# Altium schematic sheet GPS.SchDoc
size B; SheetNumber: 5; SheetTotal: 9
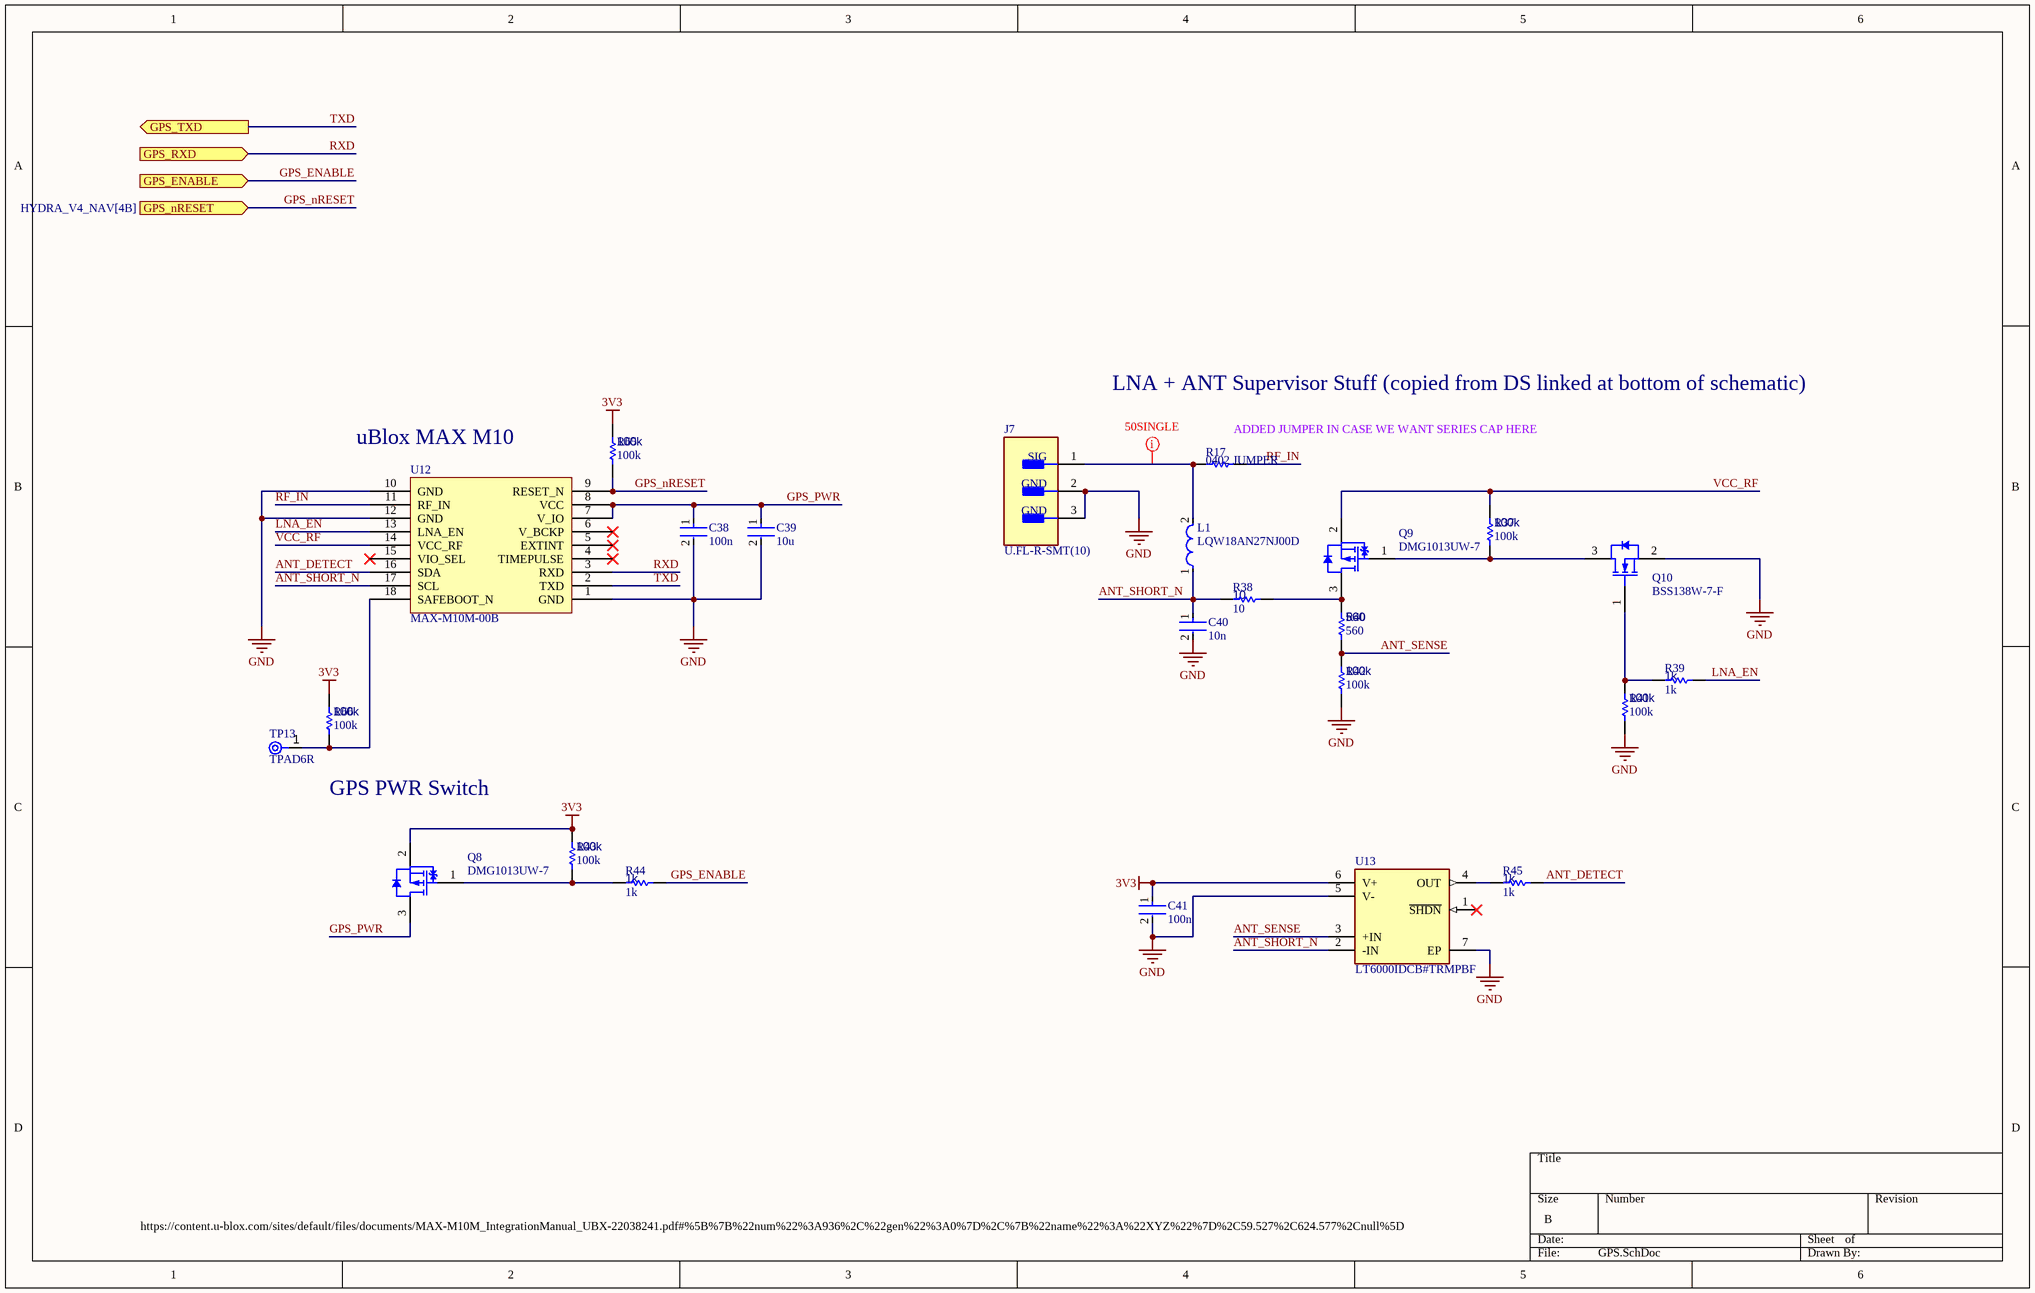
[diagram p0: GPS.SchDoc]

## Parts
C38  100n  [FP-0402-L_1_0_0_05-W_0_5-IPC_A]
C39  10u  [FP-0402-L_1_0_0_05-W_0_5-IPC_A]
C40  10n  [FP-0402-L_1_0_0_05-W_0_5-IPC_A]
C41  100n  [FP-0402-L_1_0_0_05-W_0_5-IPC_A]
J7  U.FL-R-SMT(10)  [FP-U_FL-R-SMT_10-MFG]
L1  LQW18AN27NJ00D  [FP-LQW18AN_00-MFG]
Q8  DMG1013UW-7  [DIOD-SOT323-3_V]
Q9  DMG1013UW-7  [DIOD-SOT323-3_V]
Q10  BSS138W-7-F  [DIOD-SOT323-3_V]
R17  0402 JUMPER  [RESC1005X40X25ML05T05]
R37  100k  [R0603B]
R38  10  [R0603B]
R39  1k  [R0603B]
R40  560  [R0603B]
R41  100k  [R0603B]
R42  100k  [R0603B]
R43  100k  [R0603B]
R44  1k  [R0603B]
R45  1k  [R0603B]
R65  100k  [R0603B]
R66  100k  [R0603B]
TP13  TPAD6R  [New footprint 1]
U12  MAX-M10M-00B  [MAX-M10M-00B-Footprint-1]
U13  LT6000IDCB#TRMPBF  [FP-DCB-6-05-08-1715-MFG]

## Ports
GPS_ENABLE (in, see HYDRA_V4_NAV[4B]), GPS_nRESET (in, see HYDRA_V4_NAV[4B]), GPS_RXD (in, see HYDRA_V4_NAV[4B]), GPS_TXD (out, see HYDRA_V4_NAV[4B])

## Nets
3V3: C41.1 Q8.2(S) R43.1 R65.1 R66.1 U13.6(V+)
GND: C38.2 C39.2 C40.2 C41.2 J7.2(GND) J7.3(GND) Q10.2(S) R41.2 R42.2 U12.1(GND) U12.10(GND) U12.12(GND) U13.5(V-) U13.7(EP)
ANT_DETECT: R45.2 U12.16(SDA)
ANT_SENSE: R40.2 R42.1 U13.3(+IN)
ANT_SHORT_N: C40.1 L1.1 R38.1 U12.17(SCL) U13.2(-IN)
GPS_ENABLE: R44.2 ; port GPS_ENABLE
GPS_nRESET: R65.2 U12.9(RESET_N) ; port GPS_nRESET
GPS_PWR: C38.1 C39.1 Q8.3(D) U12.7(V_IO) U12.8(VCC)
LNA_EN: R39.2 U12.13(LNA_EN)
RF_IN: R17.2 U12.11(RF_IN)
RXD: U12.3(RXD) ; port GPS_RXD
TXD: U12.2(TXD) ; port GPS_TXD
VCC_RF: Q9.2(S) R37.1 U12.14(VCC_RF)
NetJ7_1: J7.1(SIG) L1.2 R17.1
NetQ8_1: Q8.1(G) R43.2 R44.1
NetQ9_1: Q9.1(G) Q10.3(D) R37.2
NetQ9_3: Q9.3(D) R38.2 R40.1
NetQ10_1: Q10.1(G) R39.1 R41.1
NetR45_1: R45.1 U13.4(OUT)
NetR66_2: R66.2 TP13.1(TP) U12.18(SAFEBOOT_N)

Not connected (* = marked no-connect by the designer): U12 4(TIMEPULSE)* 5(EXTINT)* 6(V_BCKP)* 15(VIO_SEL)*; U13 1(~{SHDN})*

## Layout directives
net class 50SINGLE: NetJ7_1

## Notes on the sheet
- LNA + ANT Supervisor Stuff (copied from DS linked at bottom of schematic)
- (near R17) ADDED JUMPER IN CASE WE WANT SERIES CAP HERE
- (near U12) uBlox MAX M10
- GPS PWR Switch
- https://content.u-blox.com/sites/default/files/documents/MAX-M10M_IntegrationManual_UBX-22038241.pdf#%5B%7B%22num%22%3A936%2C%22gen%22%3A0%7D%2C%7B%22name%22%3A%22XYZ%22%7D%2C59.527%2C624.577%2Cnull%5D

## Library data of the parts
C38-C41 = CMP-001-00058-1: LARGE PADS, 0402 CAP, CHANGE COMMENT TO MATCH REAL P/N; Capacitor Type: Ceramic; Min Operating Temperature: -55°C; Mounting Technology: Surface Mount; Pins: 2; Case/Package: 0402; RoHS Compliant: Yes; Max Operating Temperature: 85°C
  C38 C41: Value: 100n
  C39: Value: 10u
  C40: Value: 10n
J7 = CMP-0029-00003-2: CONN U.FL RCPT STR 50 OHM SMD; Plating: Silver; Connector Type: Coaxial; Frequency: 6GHz; Impedance: 50R; Body Material: Bronze; Dielectric Material: Polymer; Contact Plating: Gold; Termination: Solder; Orientation: Vertical; Contact Material: Brass; Min Operating Temperature: -40°C; Mount: Surface Mount; Lead Free: Lead Free; Max Operating Temperature: 90°C; Radiation Hardening: No; Packaging: Tape and Reel; Body Plating: Silver; Fastening Type: Snap; Max Frequency: 6GHz; Depth: 3.1mm; Package Quantity: 1; Case/Package: SMD/SMT; Housing Color: Beige; Length: 3mm
L1 = CMP-06042-013840-1: Wire Wound RF Inductor 27nH ±5% 440mA 0.21Ω 0603 (1608); Shielding: Unshielded; Test Frequency: 100MHz; Q Factor: 40; Self Resonant Frequency: 3.7GHz; DC Resistance (DCR): 210mR; Core Material: Non-Magnetic; Depth: 1mm; Min Operating Temperature: -55°C; Package Quantity: 4000; Inductance: 27nH; Case Code (Metric): 1608; Height - Seated (Max): 0.039inch; Resistor Type: Wirewound; Max DC Current: 440mA; Tolerance: 5%; Length: 1.6mm; Mount: Surface Mount; DC Current: 440mA; Packaging: Tape and Reel; Lead Free: Lead Free; Case Code (Imperial): 0603; Current Rating: 440mA; Width: 0.8mm; Max Operating Temperature: 125°C; Termination: SMD/SMT; Weight: 0.000106oz; Radiation Hardening: No; Height: 0.8mm; Case/Package: 0603; Military Standard: Not
Q8 Q9 = CMP-2000-06170-1: P-Channel Enhancement Mode MOSFET, 310 mW, 20 V, -55 to 150 degC, 3-Pin SOT-323, RoHS, Tape and Reel; Manufacturer: Diodes Inc; Qg Gate Charge: 0.622nC; Drain-Source On Resistance-Max: 750mO; Rated Power Dissipation: 310mW; Drain-to-Source Voltage [Vdss]: 20V; Package Reference: SOT323; Datasheet Version: Rev. 3-2, 09/2013; Package Description: 3-Pin Small Outline Transistor, Body 2 x 1.25 mm, Pitch 0.65 mm; Mounting Technology: SurfaceMount; Manufacturer URL: http://www.diodes.com/; Datasheet URL: http://www.diodes.com/_files/datasheets/ds31861.pdf; Channel Type: P-Channel
Q10 = CMP-2000-05968-1: N-Channel Enhancement Mode Mosfet, 50 V, 200 mA, -55 to 150 degC, 6-Pin SOT-323, RoHS, Tape and Reel; Typical Turn-Off Delay Time: 20ns; Number of Channels: 1Channel; Type: EnhancementModeFieldEffectTransistor; Brand: DiodesIncorporated; Vds - Drain-Source Breakdown Voltage: 75V; Vgs - Gate-Source Voltage: 20V; Rds On - Drain-Source Resistance: 1.4Ohms; Transistor Type: 1N-Channel; Configuration: Single; Unit Weight: 0.000212oz; Pd - Power Dissipation: 200mW; Id - Continuous Drain Current: 200mA; Forward Transconductance - Min: 0.1S; Manufacturer URL: http://www.diodes.com/; Series: BSS138; Package Description: 3-Pin Small Outline Transistor, Body 2 x 1.25 mm, Pitch 0.65 mm; Mounting Technology: SurfaceMount; Product Category: MOSFET; RoHS: True; Maximum Operating Temperature: +150C; Height: 1mm; Length: 2.2mm; Technology: Si; Width: 1.35mm; Datasheet URL: http://www.diodes.com/_files/datasheets/ds30206.pdf; Manufacturer: DiodesIncorporated; Package / Case: SOT-323-3; Typical Turn-On Delay Time: 20ns; Transistor Polarity: N-Channel; Factory Pack Quantity: 3000; Packaging: Reel; Product: MOSFETSmallSignal; Datasheet Version: Rev. 11-2, 09/2013; Package Reference: SOT323; Minimum Operating Temperature: -55C; Mounting Style: SMD/SMT; Channel Mode: Enhancement
R17 = CMP-009-00118-2: READ THE NAME; Pins: 2; Component Type: Standard; Design Item ID: CMP-009-00206-2; Source: 0402jump.SchLib; Value: 0402 JUMPER
R37-R45 R65 R66 = CMP-009-00002-14: Resistor
  R37 R41-R43 R65 R66: Value: 100k
  R38: Value: 10
  R39 R44 R45: Value: 1k
  R40: Value: 560
TP13 = CMP-00025-2: Test Point .6mm
U12 = CMP-010-00031-2: Gnss Lcc Rx Mod, Rom, Crystal
U13 = CMP-09116-000039-1: IC OPAMP GP 1 CIRCUIT 6DFN; Number of Elements: 1; Power Supply Rejection Ratio (PSRR): 86dB; Output Current per Channel: 10mA; Gain Bandwidth Product: 60kHz; Operating Supply Current: 20uA; Input Bias Current: 12nA; Voltage Gain: 120dB; Max Supply Voltage: 18V; Input Offset Voltage (Vos): 1.2mV; Min Supply Voltage: 1.8V; Slew Rate: 0.018V/µs; Common Mode Rejection Ratio: 68dB; Packaging: Tape and Reel; Mount: Surface Mount; Case/Package: DFN; Max Operating Temperature: 85°C; Number of Pins: 6; Number of Amplifiers: 1; REACH SVHC: No SVHC; Unity Gain Bandwidth Product: 60kHz; Bandwidth: 60kHz; Lead Free: Lead Free; Number of Circuits: 1; Min Operating Temperature: -40°C; Package Quantity: 1